# Altium project FlyControl.PrjPCB
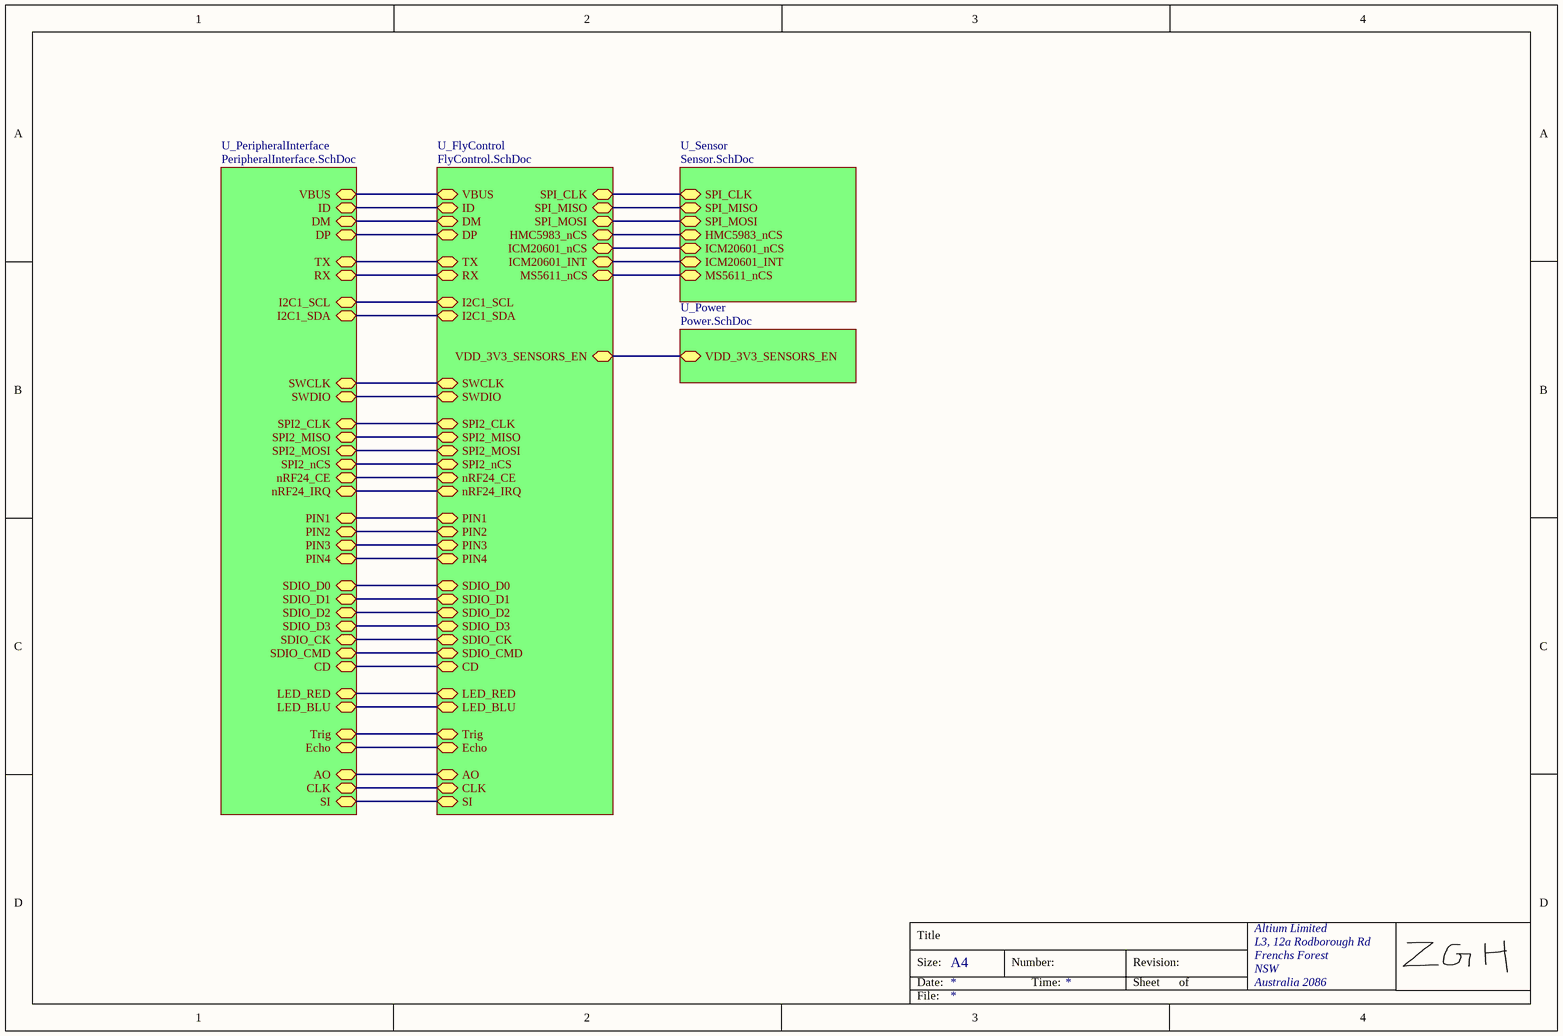
[diagram p0: Top.SchDoc]
5 sheets, 80 parts. Net scope: hierarchical (ports join the sheet entries above them; power ports are global).
Board file: Mag.PcbDoc
Sheets:
  Top.SchDoc
    U_FlyControl = FlyControl.SchDoc
    U_Sensor = Sensor.SchDoc
    U_Power = Power.SchDoc
    U_PeripheralInterface = PeripheralInterface.SchDoc

## Sheet Top.SchDoc
size A4; Organization: Altium Limited; Address1: L3, 12a Rodborough Rd; Address2: Frenchs Forest; Address3: NSW; Address4: Australia 2086

### Sub-sheets
U_FlyControl = FlyControl.SchDoc: ICM20601_nCS, HMC5983_nCS, SPI_MOSI, SPI_MISO, SPI_CLK, VDD_3V3_SENSORS_EN, VBUS, ID, DM, DP, TX, RX, I2C1_SCL, I2C1_SDA, SWCLK, SWDIO, SPI2_CLK, SPI2_MISO, SPI2_MOSI, SPI2_nCS, PIN1, PIN2, PIN3, PIN4, SDIO_D2, SDIO_D3, SDIO_D0, SDIO_D1, SDIO_CK, SDIO_CMD, CD, LED_BLU, LED_RED, nRF24_CE, nRF24_IRQ, Trig, Echo, AO, CLK, SI, ICM20601_INT, MS5611_nCS
U_PeripheralInterface = PeripheralInterface.SchDoc: VBUS, ID, DM, DP, TX, RX, I2C1_SCL, I2C1_SDA, SWCLK, SWDIO, SPI2_CLK, SPI2_MISO, SPI2_MOSI, SPI2_nCS, PIN1, PIN2, PIN3, PIN4, SDIO_D2, SDIO_D3, SDIO_D0, SDIO_D1, SDIO_CK, SDIO_CMD, CD, LED_BLU, LED_RED, nRF24_CE, nRF24_IRQ, Trig, Echo, AO, CLK, SI
U_Power = Power.SchDoc: VDD_3V3_SENSORS_EN
U_Sensor = Sensor.SchDoc: SPI_CLK, SPI_MISO, SPI_MOSI, HMC5983_nCS, ICM20601_nCS, ICM20601_INT, MS5611_nCS

### Nets
SPI_CLK: sheet U_FlyControl/SPI_CLK, sheet U_Sensor/SPI_CLK
SPI_MISO: sheet U_FlyControl/SPI_MISO, sheet U_Sensor/SPI_MISO
SPI_MOSI: sheet U_FlyControl/SPI_MOSI, sheet U_Sensor/SPI_MOSI
VBUS: sheet U_FlyControl/VBUS, sheet U_PeripheralInterface/VBUS
NetD1_2: sheet U_FlyControl/LED_RED, sheet U_PeripheralInterface/LED_RED
NetD2_2: sheet U_FlyControl/LED_BLU, sheet U_PeripheralInterface/LED_BLU
NetP1_1: sheet U_FlyControl/PIN1, sheet U_PeripheralInterface/PIN1
NetP3_1: sheet U_FlyControl/PIN2, sheet U_PeripheralInterface/PIN2
NetP4_4: sheet U_FlyControl/ID, sheet U_PeripheralInterface/ID
NetP5_1: sheet U_FlyControl/PIN3, sheet U_PeripheralInterface/PIN3
NetP6_1: sheet U_FlyControl/PIN4, sheet U_PeripheralInterface/PIN4
NetP7_3: sheet U_FlyControl/RX, sheet U_PeripheralInterface/RX
NetP7_4: sheet U_FlyControl/TX, sheet U_PeripheralInterface/TX
NetP8_1: sheet U_FlyControl/SWCLK, sheet U_PeripheralInterface/SWCLK
NetP8_3: sheet U_FlyControl/SWDIO, sheet U_PeripheralInterface/SWDIO
NetP9#1_2: sheet U_FlyControl/Trig, sheet U_PeripheralInterface/Trig
NetP9#1_3: sheet U_FlyControl/Echo, sheet U_PeripheralInterface/Echo
NetP10_2: sheet U_FlyControl/I2C1_SCL, sheet U_PeripheralInterface/I2C1_SCL
NetP10_3: sheet U_FlyControl/I2C1_SDA, sheet U_PeripheralInterface/I2C1_SDA
NetP11_3: sheet U_FlyControl/nRF24_CE, sheet U_PeripheralInterface/nRF24_CE
NetP11_4: sheet U_FlyControl/SPI2_nCS, sheet U_PeripheralInterface/SPI2_nCS
NetP11_5: sheet U_FlyControl/SPI2_CLK, sheet U_PeripheralInterface/SPI2_CLK
NetP11_6: sheet U_FlyControl/SPI2_MOSI, sheet U_PeripheralInterface/SPI2_MOSI
NetP11_7: sheet U_FlyControl/SPI2_MISO, sheet U_PeripheralInterface/SPI2_MISO
NetP11_8: sheet U_FlyControl/nRF24_IRQ, sheet U_PeripheralInterface/nRF24_IRQ
NetP12_3: sheet U_FlyControl/AO, sheet U_PeripheralInterface/AO
NetP12_4: sheet U_FlyControl/CLK, sheet U_PeripheralInterface/CLK
NetP12_5: sheet U_FlyControl/SI, sheet U_PeripheralInterface/SI
NetR3_2: sheet U_FlyControl/DM, sheet U_PeripheralInterface/DM
NetR4_2: sheet U_FlyControl/DP, sheet U_PeripheralInterface/DP
NetR7_1: sheet U_FlyControl/SDIO_D2, sheet U_PeripheralInterface/SDIO_D2
NetR8_1: sheet U_FlyControl/SDIO_D3, sheet U_PeripheralInterface/SDIO_D3
NetR9_1: sheet U_FlyControl/SDIO_CMD, sheet U_PeripheralInterface/SDIO_CMD
NetR10_1: sheet U_FlyControl/CD, sheet U_PeripheralInterface/CD
NetR11_1: sheet U_FlyControl/SDIO_D1, sheet U_PeripheralInterface/SDIO_D1
NetR12_1: sheet U_FlyControl/SDIO_D0, sheet U_PeripheralInterface/SDIO_D0
NetSD1_5: sheet U_FlyControl/SDIO_CK, sheet U_PeripheralInterface/SDIO_CK
NetU1_15: sheet U_FlyControl/ICM20601_INT, sheet U_Sensor/ICM20601_INT
NetU1_17: sheet U_FlyControl/ICM20601_nCS, sheet U_Sensor/ICM20601_nCS
NetU1_43: sheet U_FlyControl/HMC5983_nCS, sheet U_Sensor/HMC5983_nCS
NetU1_45: sheet U_FlyControl/VDD_3V3_SENSORS_EN, sheet U_Power/VDD_3V3_SENSORS_EN
NetU1_47: sheet U_FlyControl/MS5611_nCS, sheet U_Sensor/MS5611_nCS

### Notes on the sheet
- Title
- Size:
- Date:
- A4
- Number:
- Time:
- Revision:
- Sheet
- of
- File:

## Sheet FlyControl.SchDoc: FlyControl
size A4; Organization: Altium Limited; Address1: L3, 12a Rodborough Rd; Address2: Frenchs Forest; Address3: NSW; Address4: Australia 2086
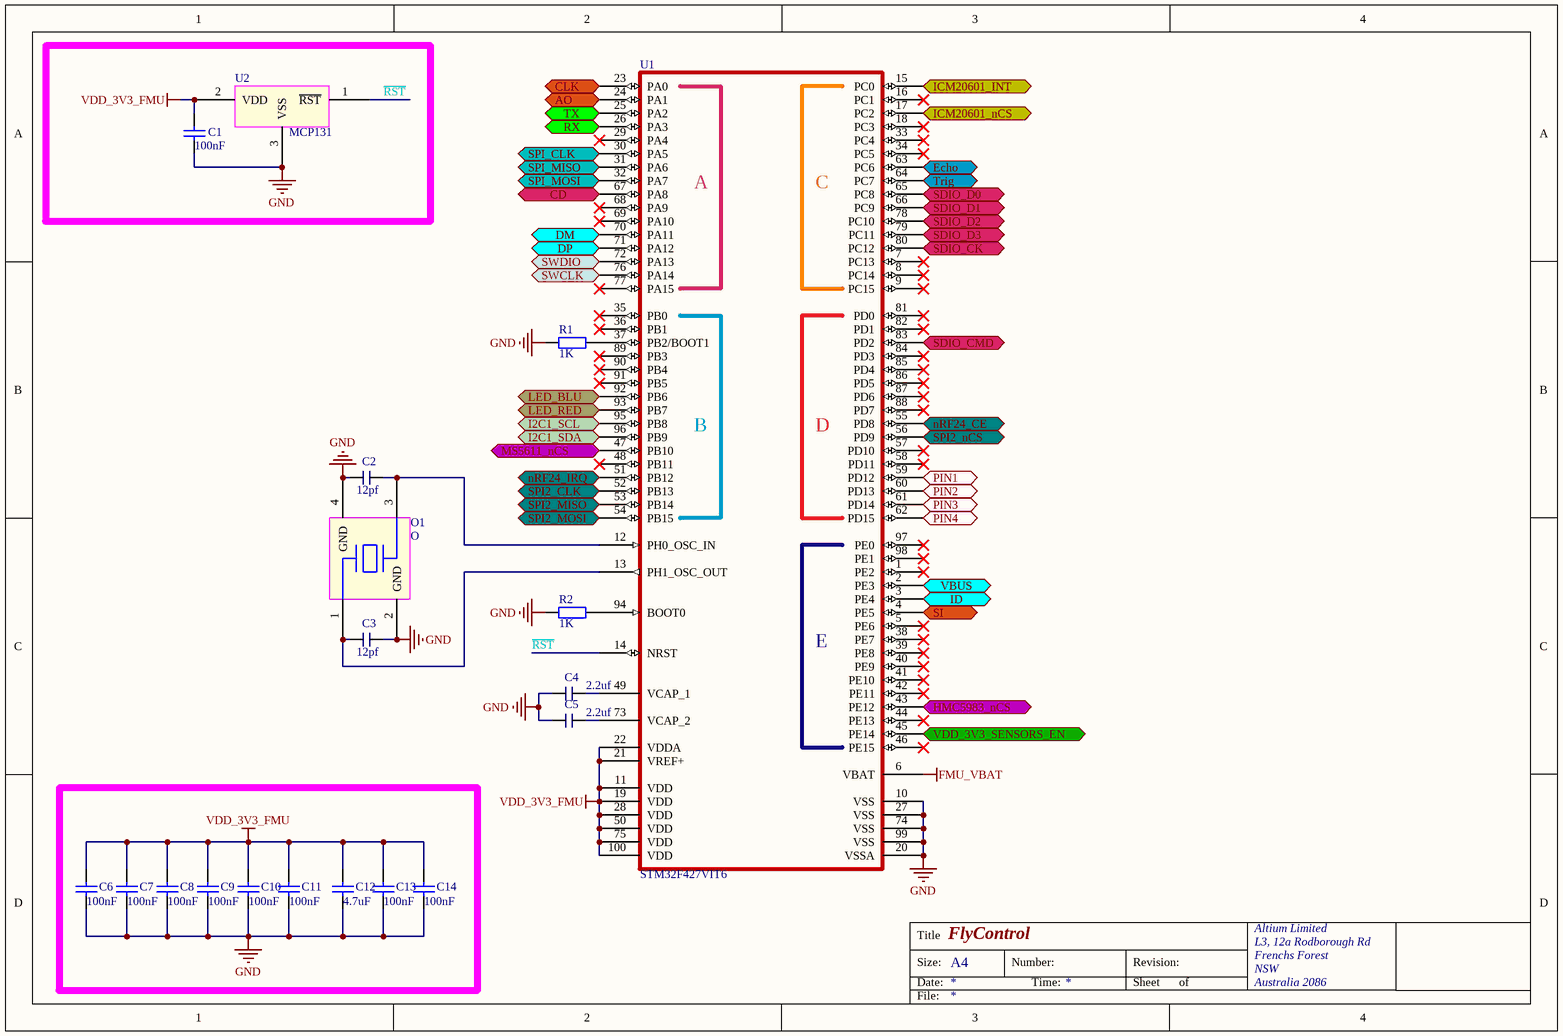
[diagram p1: FlyControl.SchDoc]

### Parts
C1  value 100nF  [0603AC]  (hidden comment: Cap1)
C2  value 12pf  [0603AC]  (hidden comment: Capacity)
C3  value 12pf  [0603AC]  (hidden comment: Capacity)
C4  value 2.2uf  [0603AC]  (hidden comment: Capacity)
C5  value 2.2uf  [0603AC]  (hidden comment: Capacity)
C6  value 100nF  [0603AC]  (hidden comment: Cap1)
C7  value 100nF  [0603AC]  (hidden comment: Cap1)
C8  value 100nF  [0603AC]  (hidden comment: Cap1)
C9  value 100nF  [0603AC]  (hidden comment: Cap1)
C10  value 100nF  [0603AC]  (hidden comment: Cap1)
C11  value 100nF  [0603AC]  (hidden comment: Cap1)
C12  value 4.7uF  [0603AC]  (hidden comment: Cap1)
C13  value 100nF  [0603AC]  (hidden comment: Cap1)
C14  value 100nF  [0603AC]  (hidden comment: Cap1)
O1  O  [SMD_3225]
R1  value 1K  [0603AR]  (hidden comment: Resist)
R2  value 1K  [0603AR]  (hidden comment: Resist)
U1  STM32F427VIT6  [LQFP50P1600X1600X160-100N]
U2  MCP131  [SOT23]

### Ports
AO, CD, CLK, DM, DP, Echo, HMC5983_nCS, I2C1_SCL, I2C1_SDA, ICM20601_INT, ICM20601_nCS, ID, LED_BLU, LED_RED, MS5611_nCS, nRF24_CE, nRF24_IRQ, PIN1, PIN2, PIN3, PIN4, RX, SDIO_CK, SDIO_CMD, SDIO_D0, SDIO_D1, SDIO_D2, SDIO_D3, SI, SPI2_CLK, SPI2_MISO, SPI2_MOSI, SPI2_nCS, SPI_CLK, SPI_MISO, SPI_MOSI, SWCLK, SWDIO, Trig, TX, VBUS, VDD_3V3_SENSORS_EN

### Nets
FMU_VBAT: U1.6(VBAT)
GND: C1.1 C2.1 C3.2 C4.1 C5.1 C6.1 C7.1 C8.1 C9.1 C10.1 C11.1 C12.1 C13.1 C14.1 O1.2(GND) O1.4(GND) R1.1 R2.1 U1.10(VSS) U1.20(VSSA) U1.27(VSS) U1.74(VSS) U1.99(VSS) U2.3(VSS)
VDD_3V3_FMU: C1.2 C6.2 C7.2 C8.2 C9.2 C10.2 C11.2 C12.2 C13.2 C14.2 U1.11(VDD) U1.19(VDD) U1.21(VREF+) U1.22(VDDA) U1.28(VDD) U1.50(VDD) U1.75(VDD) U1.100(VDD) U2.2(VDD)
~{RST}: U1.14(NRST) U2.1(~{RST})
SPI_CLK: U1.30(PA5) ; port SPI_CLK
SPI_MISO: U1.31(PA6) ; port SPI_MISO
SPI_MOSI: U1.32(PA7) ; port SPI_MOSI
VBUS: U1.2(PE3) ; port VBUS
NetC2_2: C2.2 O1.3(OSC) U1.12(PH0_OSC_IN)
NetC3_1: C3.1 O1.1(OSC) U1.13(PH1_OSC_OUT)
NetC4_2: C4.2 U1.49(VCAP_1)
NetC5_2: C5.2 U1.73(VCAP_2)
NetD1_2: U1.93(PB7) ; port LED_RED
NetD2_2: U1.92(PB6) ; port LED_BLU
NetP1_1: U1.59(PD12) ; port PIN1
NetP3_1: U1.60(PD13) ; port PIN2
NetP4_4: U1.3(PE4) ; port ID
NetP5_1: U1.61(PD14) ; port PIN3
NetP6_1: U1.62(PD15) ; port PIN4
NetP7_3: U1.26(PA3) ; port RX
NetP7_4: U1.25(PA2) ; port TX
NetP8_1: U1.76(PA14) ; port SWCLK
NetP8_3: U1.72(PA13) ; port SWDIO
NetP9#1_2: U1.64(PC7) ; port Trig
NetP9#1_3: U1.63(PC6) ; port Echo
NetP10_2: U1.95(PB8) ; port I2C1_SCL
NetP10_3: U1.96(PB9) ; port I2C1_SDA
NetP11_3: U1.55(PD8) ; port nRF24_CE
NetP11_4: U1.56(PD9) ; port SPI2_nCS
NetP11_5: U1.52(PB13) ; port SPI2_CLK
NetP11_6: U1.54(PB15) ; port SPI2_MOSI
NetP11_7: U1.53(PB14) ; port SPI2_MISO
NetP11_8: U1.51(PB12) ; port nRF24_IRQ
NetP12_3: U1.24(PA1) ; port AO
NetP12_4: U1.23(PA0) ; port CLK
NetP12_5: U1.4(PE5) ; port SI
NetR1_2: R1.2 U1.37(PB2/BOOT1)
NetR2_2: R2.2 U1.94(BOOT0)
NetR3_2: U1.70(PA11) ; port DM
NetR4_2: U1.71(PA12) ; port DP
NetR7_1: U1.78(PC10) ; port SDIO_D2
NetR8_1: U1.79(PC11) ; port SDIO_D3
NetR9_1: U1.83(PD2) ; port SDIO_CMD
NetR10_1: U1.67(PA8) ; port CD
NetR11_1: U1.66(PC9) ; port SDIO_D1
NetR12_1: U1.65(PC8) ; port SDIO_D0
NetSD1_5: U1.80(PC12) ; port SDIO_CK
NetU1_15: U1.15(PC0) ; port ICM20601_INT
NetU1_17: U1.17(PC2) ; port ICM20601_nCS
NetU1_43: U1.43(PE12) ; port HMC5983_nCS
NetU1_45: U1.45(PE14) ; port VDD_3V3_SENSORS_EN
NetU1_47: U1.47(PB10) ; port MS5611_nCS

Not connected (* = marked no-connect by the designer): U1 1(PE2)* 5(PE6)* 7(PC13)* 8(PC14)* 9(PC15)* 16(PC1)* 18(PC3)* 29(PA4)* 33(PC4)* 34(PC5)* 35(PB0)* 36(PB1)* 38(PE7)* 39(PE8)* 40(PE9)* 41(PE10)* 42(PE11)* 44(PE13)* 46(PE15)* 48(PB11)* 57(PD10)* 58(PD11)* 68(PA9)* 69(PA10)* 77(PA15)* 81(PD0)* 82(PD1)* 84(PD3)* 85(PD4)* 86(PD5)* 87(PD6)* 88(PD7)* 89(PB3)* 90(PB4)* 91(PB5)* 97(PE0)* 98(PE1)*

### Notes on the sheet
- Title
- Size:
- Date:
- A4
- Number:
- Time:
- Revision:
- Sheet
- of
- File:
- (in symbol STM32F427VIT6) A; C; B; D; E

### Library data of the parts
C1 C6-C14 = Cap1: Capacitor; Published: 8-Jun-2000; LatestRevisionDate: 17-Jul-2002; LatestRevisionNote: Re-released for DXP Platform.; PackageReference: RAD-0.3; Publisher: Altium Limited; PackageDescription: Radial Cap, Thru-Hole; 2 Leads; 0.3 in Pin Spacing
C2-C5 = Cap
O1 = OSC
R1 R2 = Res

## Sheet Sensor.SchDoc: Sensor
size A4; Organization: Altium Limited; Address1: L3, 12a Rodborough Rd; Address2: Frenchs Forest; Address3: NSW; Address4: Australia 2086
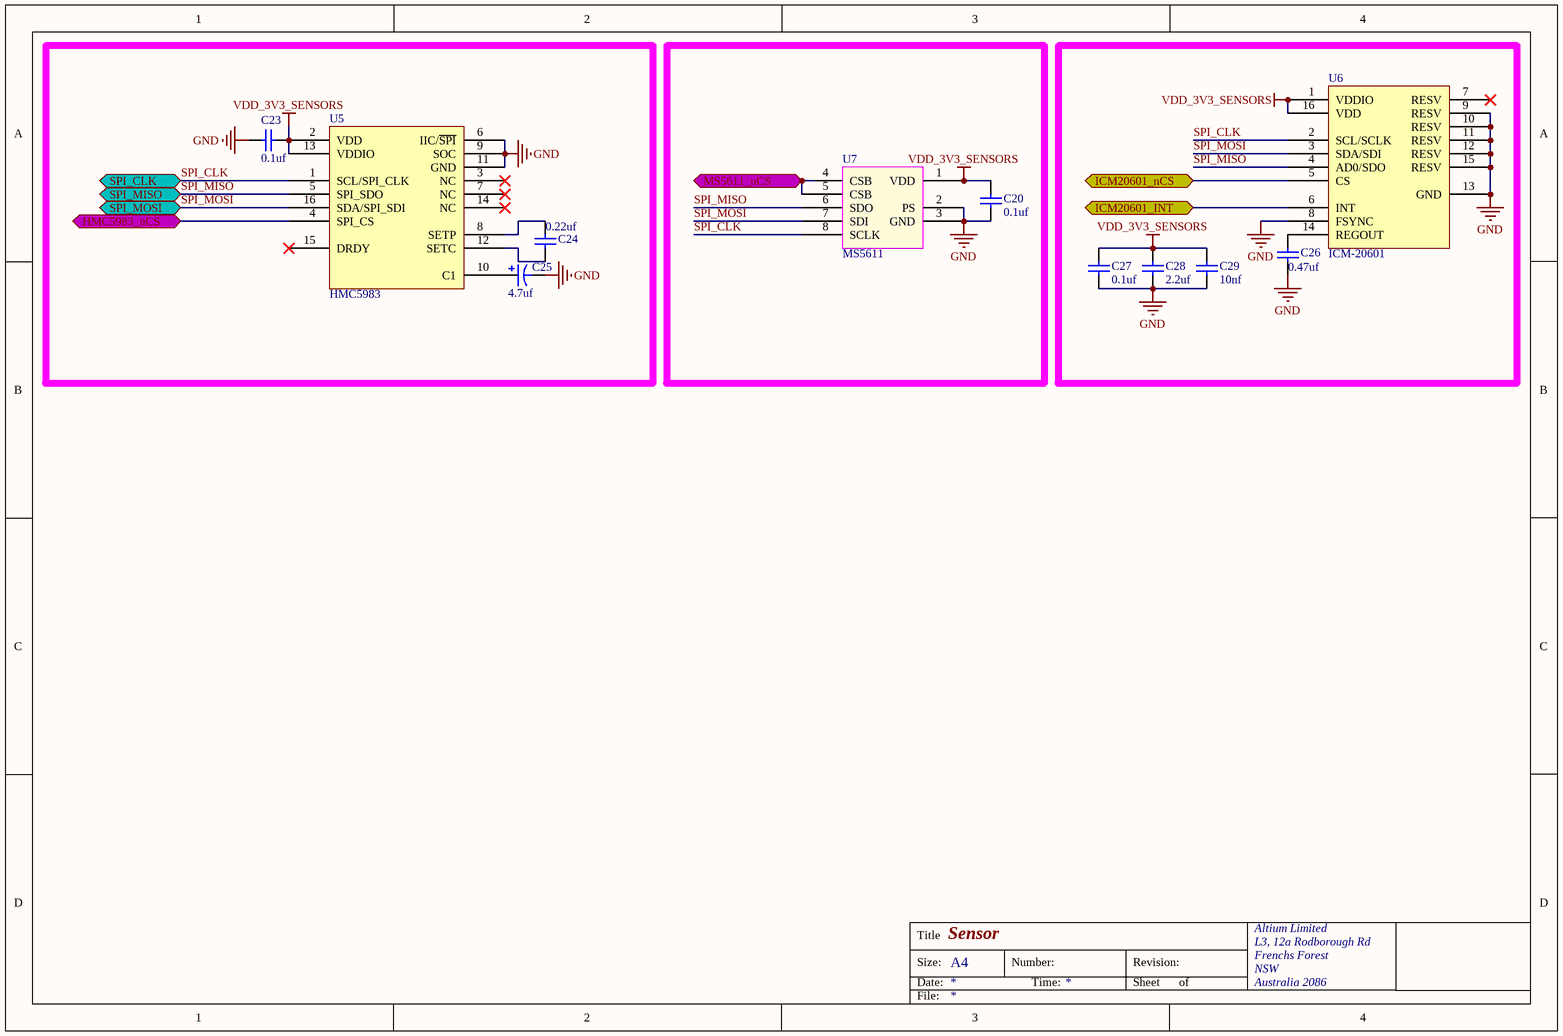
[diagram p2: Sensor.SchDoc]

### Parts
C20  value 0.1uf  [0603AC]  (hidden comment: Cap1)
C23  value 0.1uf  [0603AC]  (hidden comment: Cap1)
C24  value 0.22uf  [0603AC]  (hidden comment: Cap1)
C25  value 4.7uf  [0603AC]  (hidden comment: Cap Pol1)
C26  value 0.47uf  [0603AC]  (hidden comment: Cap1)
C27  value 0.1uf  [0603AC]  (hidden comment: Cap1)
C28  value 2.2uf  [0603AC]  (hidden comment: Cap1)
C29  value 10nf  [0603AC]  (hidden comment: Cap1)
U5  HMC5983  [LPCC-16PIN]
U6  ICM-20601  [LGA-16PIN]
U7  MS5611  [MS5611]

### Ports
HMC5983_nCS, ICM20601_INT, ICM20601_nCS, MS5611_nCS, SPI_CLK, SPI_MISO, SPI_MOSI

### Nets
GND: C20.2 C23.2 C25.2 C26.1 C27.2 C28.2 C29.2 U5.6(IIC/~{SPI}) U5.9(SOC) U5.11(GND) U6.8(FSYNC) U6.9(RESV) U6.10(RESV) U6.11(RESV) U6.12(RESV) U6.13(GND) U6.15(RESV) U7.2(PS) U7.3(GND)
VDD_3V3_SENSORS: C20.1 C23.1 C27.1 C28.1 C29.1 U5.2(VDD) U5.13(VDDIO) U6.1(VDDIO) U6.16(VDD) U7.1(VDD)
SPI_CLK: U5.1(SCL/SPI_CLK) U6.2(SCL/SCLK) U7.8(SCLK) ; port SPI_CLK
SPI_MISO: U5.5(SPI_SDO) U6.4(AD0/SDO) U7.6(SDO) ; port SPI_MISO
SPI_MOSI: U5.16(SDA/SPI_SDI) U6.3(SDA/SDI) U7.7(SDI) ; port SPI_MOSI
NetC24_1: C24.1 U5.12(SETC)
NetC24_2: C24.2 U5.8(SETP)
NetC25_1: C25.1 U5.10(C1)
NetC26_2: C26.2 U6.14(REGOUT)
NetU1_15: U6.6(INT) ; port ICM20601_INT
NetU1_17: U6.5(CS) ; port ICM20601_nCS
NetU1_43: U5.4(SPI_CS) ; port HMC5983_nCS
NetU1_47: U7.4(CSB) U7.5(CSB) ; port MS5611_nCS

Not connected (* = marked no-connect by the designer): U5 3(NC)* 7(NC)* 14(NC)* 15(DRDY)*; U6 7(RESV)*

### Notes on the sheet
- Title
- Size:
- Date:
- A4
- Number:
- Time:
- Revision:
- Sheet
- of
- File:

### Library data of the parts
C20 C23 C24 C26-C29 = Cap1: Capacitor; Published: 8-Jun-2000; LatestRevisionDate: 17-Jul-2002; LatestRevisionNote: Re-released for DXP Platform.; PackageReference: RAD-0.3; Publisher: Altium Limited; PackageDescription: Radial Cap, Thru-Hole; 2 Leads; 0.3 in Pin Spacing
C25 = Cap Pol1: Polarized Capacitor (Axial); Published: 8-Jun-2000; LatestRevisionDate: 17-Jul-2002; LatestRevisionNote: Re-released for DXP Platform.; PackageReference: POLAR0.8; Publisher: Altium Limited; PackageDescription: Polarized Capacitor; 2 Leads

## Sheet Power.SchDoc: Power
size A4; Organization: Altium Limited; Address1: L3, 12a Rodborough Rd; Address2: Frenchs Forest; Address3: NSW; Address4: Australia 2086
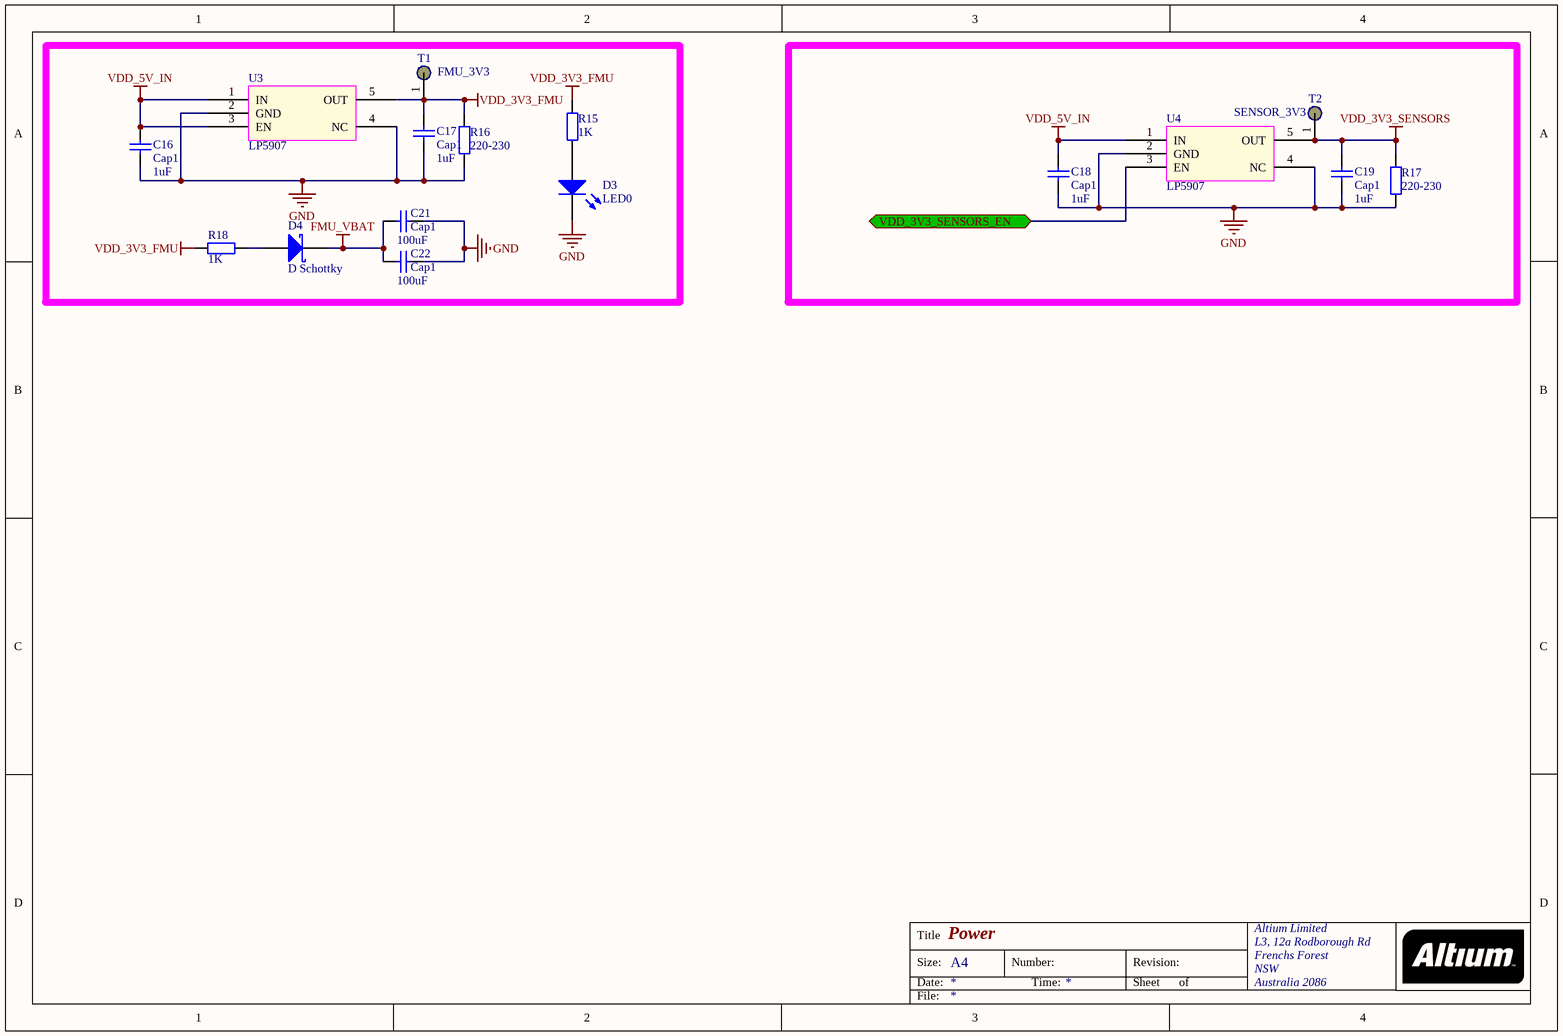
[diagram p3: Power.SchDoc]

### Parts
C16  Cap1  value 1uF  [0603AC]
C17  Cap1  value 1uF  [0603AC]
C18  Cap1  value 1uF  [0603AC]
C19  Cap1  value 1uF  [0603AC]
C21  Cap1  value 100uF  [0805C]
C22  Cap1  value 100uF  [0805C]
D3  LED0  [LED_R]
D4  D Schottky  [DO-214]
R15  value 1K  [0603AR]  (hidden comment: Resist)
R16  value 220-230  [0603AR]  (hidden comment: Resist)
R17  value 220-230  [0603AR]  (hidden comment: Resist)
R18  value 1K  [0603AR]  (hidden comment: Resist)
T1  FMU_3V3  [TAB]
T2  SENSOR_3V3  [TAB]
U3  LP5907
U4  LP5907

### Ports
VDD_3V3_SENSORS_EN

### Nets
FMU_VBAT: C21.2 C22.2 D4.2(K)
GND: C16.1 C17.1 C18.1 C19.1 C21.1 C22.1 D3.2(K) R16.1 R17.1 U3.2(GND) U3.4(NC) U4.2(GND) U4.4(NC)
VDD_3V3_FMU: C17.2 R15.2 R16.2 R18.2 T1.1 U3.5(OUT)
VDD_3V3_SENSORS: C19.2 R17.2 T2.1 U4.5(OUT)
VDD_5V_IN: C16.2 C18.2 U3.1(IN) U3.3(EN) U4.1(IN)
NetD3_1: D3.1(A) R15.1
NetD4_1: D4.1(A) R18.1
NetU1_45: U4.3(EN) ; port VDD_3V3_SENSORS_EN

### Notes on the sheet
- Title
- Size:
- Date:
- A4
- Number:
- Time:
- Revision:
- Sheet
- of
- File:

### Library data of the parts
C16-C19 C21 C22 = Cap1: Capacitor; Published: 8-Jun-2000; LatestRevisionDate: 17-Jul-2002; LatestRevisionNote: Re-released for DXP Platform.; PackageReference: RAD-0.3; Publisher: Altium Limited; PackageDescription: Radial Cap, Thru-Hole; 2 Leads; 0.3 in Pin Spacing
D3 = LED0: Typical INFRARED GaAs LED; Published: 8-Jun-2000; LatestRevisionDate: 08-Jul-2005; LatestRevisionNote: Mech Layer 1 removed.; PackageReference: LED-0; Publisher: Altium Limited; PackageDescription: LED; 2 Leads
D4 = D Schottky: Schottky Diode; Published: 8-Jun-2000; LatestRevisionDate: 17-Jul-2002; LatestRevisionNote: Re-released for DXP Platform.; PackageReference: SMB; Publisher: Altium Limited; PackageDescription: DO-214-AA/SMB; 2 C-Bend Leads; Body 5.3 x 3.6 mm, inc. leads (LxW); Code_JEDEC: DO-214-AA
R15-R18 = Res
T1 T2 = Tap

## Sheet PeripheralInterface.SchDoc: PeripheralInterface
size A4; Organization: Altium Limited; Address1: L3, 12a Rodborough Rd; Address2: Frenchs Forest; Address3: NSW; Address4: Australia 2086
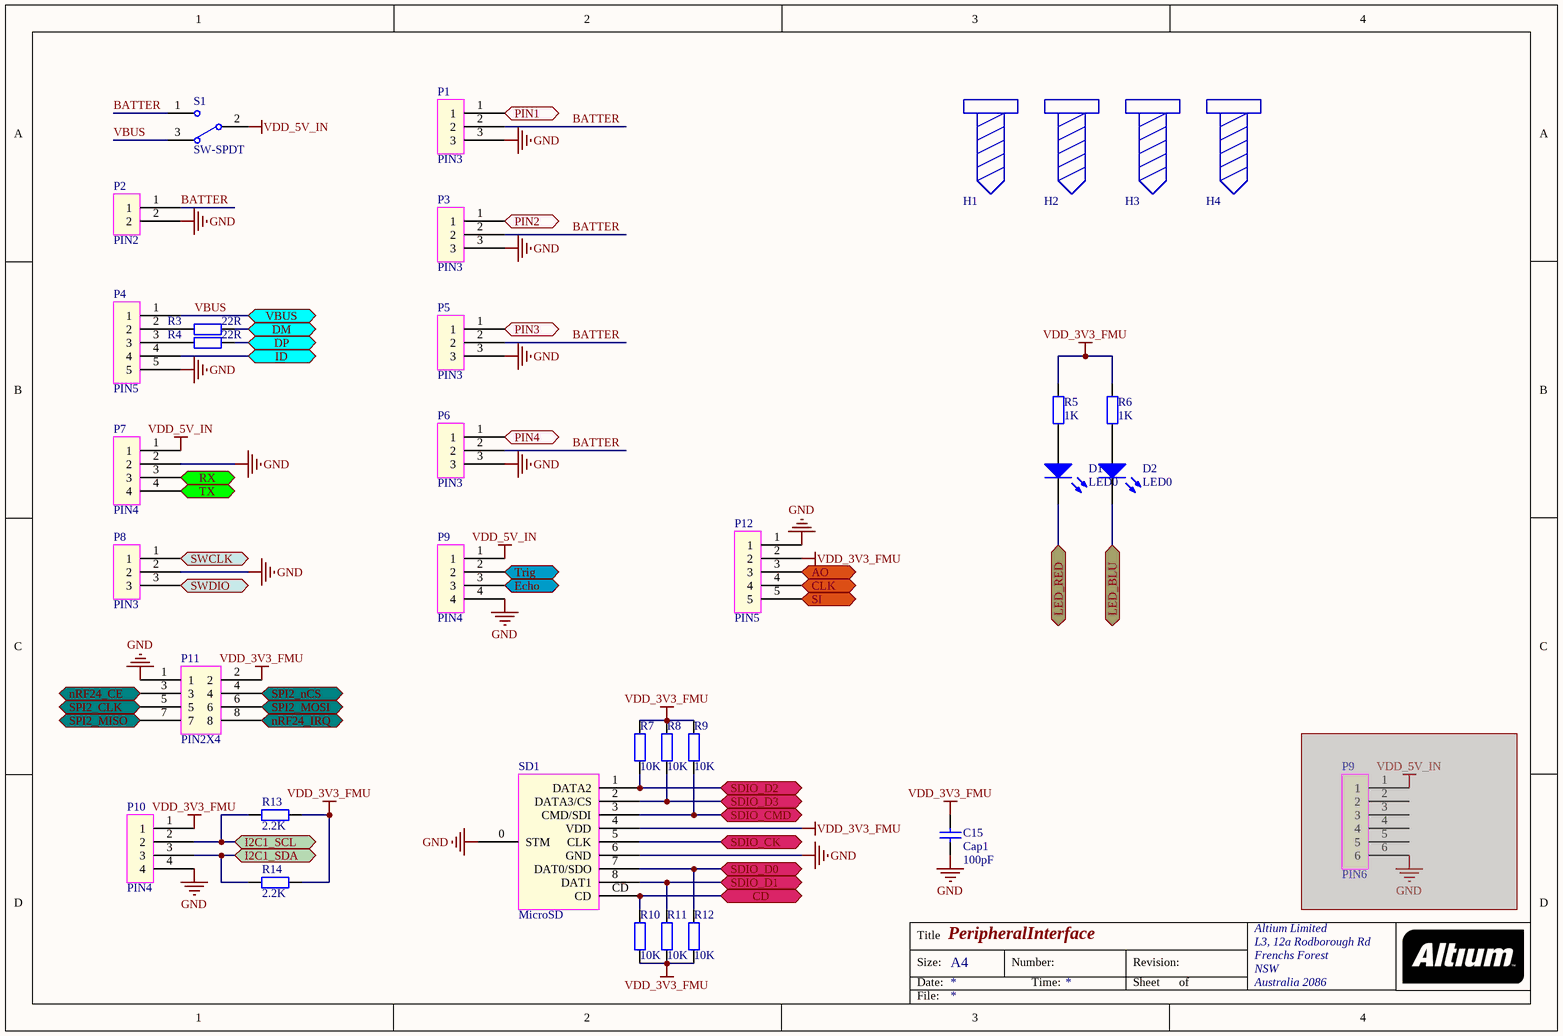
[diagram p4: PeripheralInterface.SchDoc]

### Parts
(Parts that share a designator on the sheet are numbered #1, #2 ... from top to bottom, then left to right.)
C15  Cap1  value 100pF  [0603AC]
D1  LED0  [LED_G]
D2  LED0  [LED_B]
H1  HOLE  [Hole]  (value not drawn)
H2  HOLE  [Hole]  (value not drawn)
H3  HOLE  [Hole]  (value not drawn)
H4  HOLE  [Hole]  (value not drawn)
P1  PIN3  [Header-3P]
P2  PIN2  [Header-2P]
P3  PIN3  [Header-3P]
P4  PIN5  [mini_USB]
P5  PIN3  [Header-3P]
P6  PIN3  [Header-3P]
P7  PIN4  [Header-4P]
P8  PIN3  [Header-3P]
P9#1  PIN4  [Header-4P]
P9#2  PIN6  [AWT-6]  (masked out: inside a compile mask, not in the netlist)
P10  PIN4  [AWT-4]
P11  PIN2X4  [Header-2X4P]
P12  PIN5  [Header-5P]
R3  value 22R  [0603AR]  (hidden comment: Resist)
R4  value 22R  [0603AR]  (hidden comment: Resist)
R5  value 1K  [0603AR]  (hidden comment: Resist)
R6  value 1K  [0603AR]  (hidden comment: Resist)
R7  value 10K  [0603AR]  (hidden comment: Resist)
R8  value 10K  [0603AR]  (hidden comment: Resist)
R9  value 10K  [0603AR]  (hidden comment: Resist)
R10  value 10K  [0603AR]  (hidden comment: Resist)
R11  value 10K  [0603AR]  (hidden comment: Resist)
R12  value 10K  [0603AR]  (hidden comment: Resist)
R13  value 2.2K  [0603AR]  (hidden comment: Resist)
R14  value 2.2K  [0603AR]  (hidden comment: Resist)
S1  SW-SPDT  [KEY_MSK_12C01_07]
SD1  MicroSD  [MicroSD]

### Ports
AO, CD, CLK, DM, DP, Echo, I2C1_SCL, I2C1_SDA, ID, LED_BLU, LED_RED, nRF24_CE, nRF24_IRQ, PIN1, PIN2, PIN3, PIN4, RX, SDIO_CK, SDIO_CMD, SDIO_D0, SDIO_D1, SDIO_D2, SDIO_D3, SI, SPI2_CLK, SPI2_MISO, SPI2_MOSI, SPI2_nCS, SWCLK, SWDIO, Trig, TX, VBUS

### Nets
GND: C15.1 P1.3 P2.2 P3.3 P4.5 P5.3 P6.3 P7.2 P8.2 P9#1.4 P10.4 P11.1 P12.1 SD1.0(STM) SD1.6(GND)
VDD_3V3_FMU: C15.2 P10.1 P11.2 P12.2 R5.2 R6.2 R7.2 R8.2 R9.2 R10.2 R11.2 R12.2 R13.2 R14.2 SD1.4(VDD)
VDD_5V_IN: P7.1 P9#1.1 S1.2
BATTER: P1.2 P2.1 P3.2 P5.2 P6.2 S1.1
VBUS: P4.1 S1.3 ; port VBUS
NetD1_1: D1.1(A) R5.1
NetD1_2: D1.2(K) ; port LED_RED
NetD2_1: D2.1(A) R6.1
NetD2_2: D2.2(K) ; port LED_BLU
NetP1_1: P1.1 ; port PIN1
NetP3_1: P3.1 ; port PIN2
NetP4_2: P4.2 R3.1
NetP4_3: P4.3 R4.1
NetP4_4: P4.4 ; port ID
NetP5_1: P5.1 ; port PIN3
NetP6_1: P6.1 ; port PIN4
NetP7_3: P7.3 ; port RX
NetP7_4: P7.4 ; port TX
NetP8_1: P8.1 ; port SWCLK
NetP8_3: P8.3 ; port SWDIO
NetP9#1_2: P9#1.2 ; port Trig
NetP9#1_3: P9#1.3 ; port Echo
NetP10_2: P10.2 R13.1 ; port I2C1_SCL
NetP10_3: P10.3 R14.1 ; port I2C1_SDA
NetP11_3: P11.3 ; port nRF24_CE
NetP11_4: P11.4 ; port SPI2_nCS
NetP11_5: P11.5 ; port SPI2_CLK
NetP11_6: P11.6 ; port SPI2_MOSI
NetP11_7: P11.7 ; port SPI2_MISO
NetP11_8: P11.8 ; port nRF24_IRQ
NetP12_3: P12.3 ; port AO
NetP12_4: P12.4 ; port CLK
NetP12_5: P12.5 ; port SI
NetR3_2: R3.2 ; port DM
NetR4_2: R4.2 ; port DP
NetR7_1: R7.1 SD1.1(DATA2) ; port SDIO_D2
NetR8_1: R8.1 SD1.2(DATA3/CS) ; port SDIO_D3
NetR9_1: R9.1 SD1.3(CMD/SDI) ; port SDIO_CMD
NetR10_1: R10.1 SD1.CD ; port CD
NetR11_1: R11.1 SD1.8(DAT1) ; port SDIO_D1
NetR12_1: R12.1 SD1.7(DAT0/SDO) ; port SDIO_D0
NetSD1_5: SD1.5(CLK) ; port SDIO_CK

### Notes on the sheet
- Title
- Size:
- Date:
- A4
- Number:
- Time:
- Revision:
- Sheet
- of
- File:

### Library data of the parts
C15 = Cap1: Capacitor; Published: 8-Jun-2000; LatestRevisionDate: 17-Jul-2002; LatestRevisionNote: Re-released for DXP Platform.; PackageReference: RAD-0.3; Publisher: Altium Limited; PackageDescription: Radial Cap, Thru-Hole; 2 Leads; 0.3 in Pin Spacing
D1 D2 = LED0: Typical INFRARED GaAs LED; Published: 8-Jun-2000; LatestRevisionDate: 08-Jul-2005; LatestRevisionNote: Mech Layer 1 removed.; PackageReference: LED-0; Publisher: Altium Limited; PackageDescription: LED; 2 Leads
R3-R14 = Res
S1 = SW-SPDT: SPDT Subminiature Toggle Switch, Right Angle Mounting, Vertical Actuation; Published: 24-Mar-1999; LatestRevisionDate: 17-Dec-2003; LatestRevisionNote: Schematic revised, PCB Footprint replaced.; DatasheetVersion: 05-Dec-2000; PackageReference: TL36WW15050; Publisher: Altium Limited; PackageDescription: Switch; 4 Leads; ComponentLink1Description: Manufacturer Link; ComponentLink1URL: http://www.apem.com

## Nets that join several sheets
FMU_VBAT: FlyControl (U1.6), Power (C21.2 C22.2 D4.2)
GND: FlyControl (24 pins), Sensor (19 pins), Power (13 pins), PeripheralInterface (15 pins)
VDD_3V3_FMU: FlyControl (19 pins), Power (6 pins), PeripheralInterface (15 pins)
VDD_3V3_SENSORS: Sensor (10 pins), Power (C19.2 R17.2 T2.1 U4.5)
VDD_5V_IN: Power (5 pins), PeripheralInterface (P7.1 P9#1.1 S1.2)
NetD1_2: FlyControl (U1.93), PeripheralInterface (D1.2)
NetD2_2: FlyControl (U1.92), PeripheralInterface (D2.2)
NetP1_1: FlyControl (U1.59), PeripheralInterface (P1.1)
NetP3_1: FlyControl (U1.60), PeripheralInterface (P3.1)
NetP4_4: FlyControl (U1.3), PeripheralInterface (P4.4)
NetP5_1: FlyControl (U1.61), PeripheralInterface (P5.1)
NetP6_1: FlyControl (U1.62), PeripheralInterface (P6.1)
NetP7_3: FlyControl (U1.26), PeripheralInterface (P7.3)
NetP7_4: FlyControl (U1.25), PeripheralInterface (P7.4)
NetP8_1: FlyControl (U1.76), PeripheralInterface (P8.1)
NetP8_3: FlyControl (U1.72), PeripheralInterface (P8.3)
NetP9#1_2: FlyControl (U1.64), PeripheralInterface (P9#1.2)
NetP9#1_3: FlyControl (U1.63), PeripheralInterface (P9#1.3)
NetP10_2: FlyControl (U1.95), PeripheralInterface (P10.2 R13.1)
NetP10_3: FlyControl (U1.96), PeripheralInterface (P10.3 R14.1)
NetP11_3: FlyControl (U1.55), PeripheralInterface (P11.3)
NetP11_4: FlyControl (U1.56), PeripheralInterface (P11.4)
NetP11_5: FlyControl (U1.52), PeripheralInterface (P11.5)
NetP11_6: FlyControl (U1.54), PeripheralInterface (P11.6)
NetP11_7: FlyControl (U1.53), PeripheralInterface (P11.7)
NetP11_8: FlyControl (U1.51), PeripheralInterface (P11.8)
NetP12_3: FlyControl (U1.24), PeripheralInterface (P12.3)
NetP12_4: FlyControl (U1.23), PeripheralInterface (P12.4)
NetP12_5: FlyControl (U1.4), PeripheralInterface (P12.5)
NetR3_2: FlyControl (U1.70), PeripheralInterface (R3.2)
NetR4_2: FlyControl (U1.71), PeripheralInterface (R4.2)
NetR7_1: FlyControl (U1.78), PeripheralInterface (R7.1 SD1.1)
NetR8_1: FlyControl (U1.79), PeripheralInterface (R8.1 SD1.2)
NetR9_1: FlyControl (U1.83), PeripheralInterface (R9.1 SD1.3)
NetR10_1: FlyControl (U1.67), PeripheralInterface (R10.1 SD1.CD)
NetR11_1: FlyControl (U1.66), PeripheralInterface (R11.1 SD1.8)
NetR12_1: FlyControl (U1.65), PeripheralInterface (R12.1 SD1.7)
NetSD1_5: FlyControl (U1.80), PeripheralInterface (SD1.5)
NetU1_15: FlyControl (U1.15), Sensor (U6.6)
NetU1_17: FlyControl (U1.17), Sensor (U6.5)
NetU1_43: FlyControl (U1.43), Sensor (U5.4)
NetU1_45: FlyControl (U1.45), Power (U4.3)
NetU1_47: FlyControl (U1.47), Sensor (U7.4 U7.5)
SPI_CLK: FlyControl (U1.30), Sensor (U5.1 U6.2 U7.8)
SPI_MISO: FlyControl (U1.31), Sensor (U5.5 U6.4 U7.6)
SPI_MOSI: FlyControl (U1.32), Sensor (U5.16 U6.3 U7.7)
VBUS: FlyControl (U1.2), PeripheralInterface (P4.1 S1.3)